# Altium schematic sheet i2c_video_clock.SchDoc
size A3
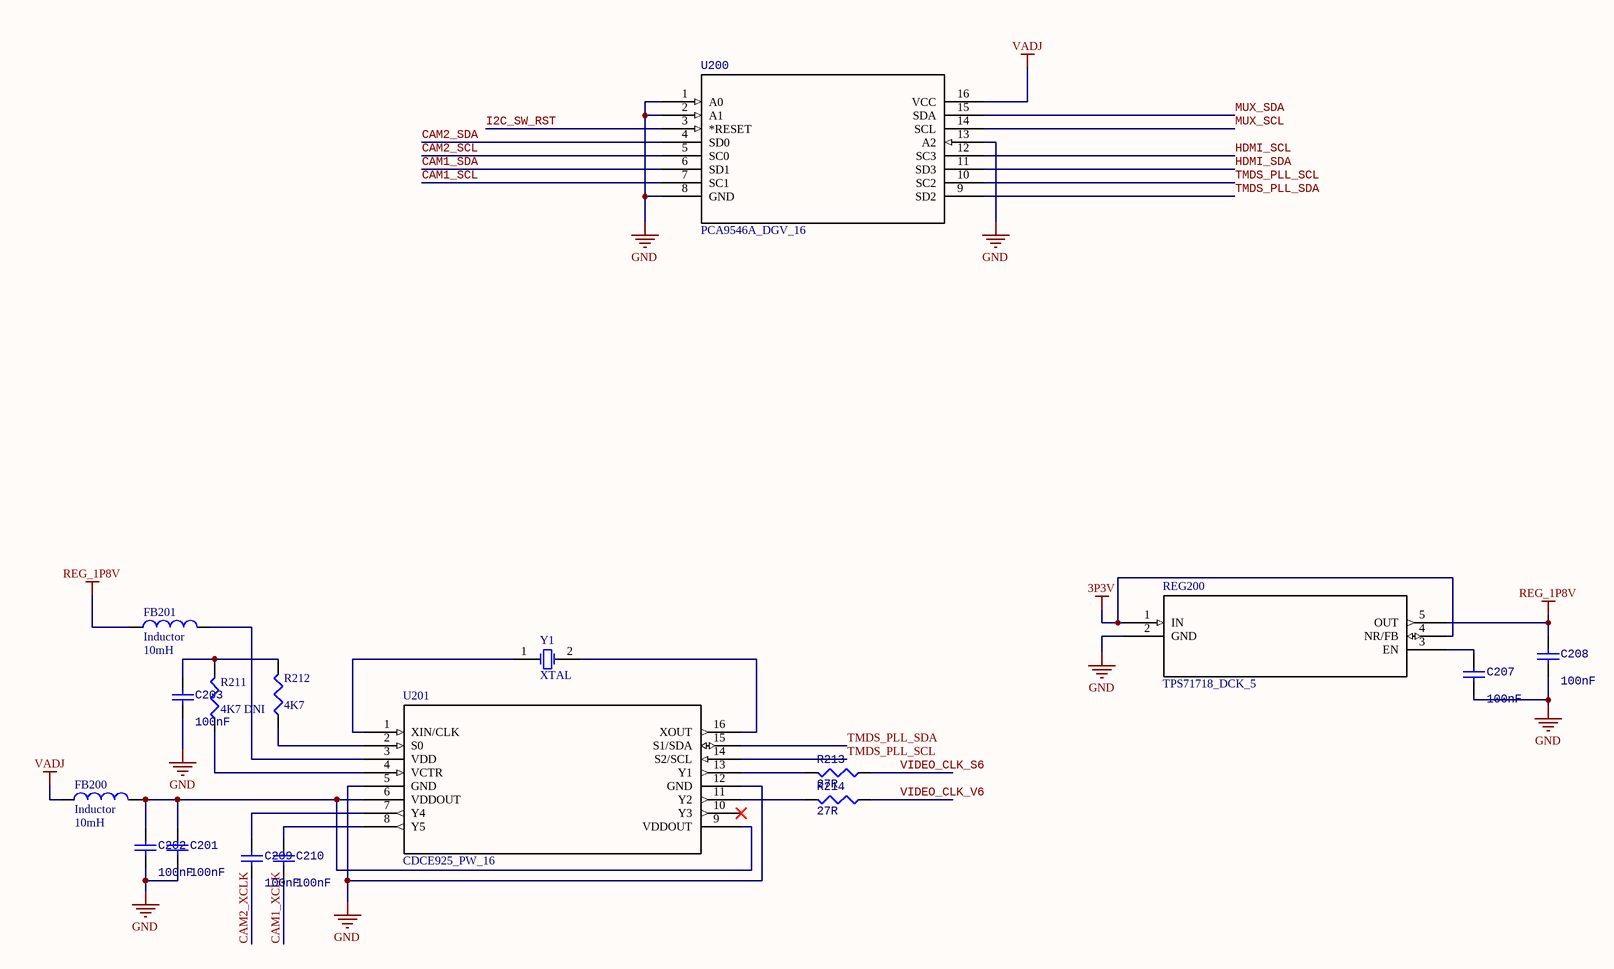
[diagram p0: i2c_video_clock.SchDoc]

## Parts
C201  value 100nF  [1608[0603]]  (hidden comment: Cap)
C202  value 100nF  [1608[0603]]  (hidden comment: Cap)
C203  value 100nF  [1608[0603]]  (hidden comment: Cap)
C207  value 100nF  [1608[0603]]  (hidden comment: Cap)
C208  value 100nF  [1608[0603]]  (hidden comment: Cap)
C209  value 100nF  [1608[0603]]  (hidden comment: Cap)
C210  value 100nF  [1608[0603]]  (hidden comment: Cap)
FB200  Inductor  value 10mH  [0603]
FB201  Inductor  value 10mH  [0603]
R211  value 4K7 DNI  [J1-0603]  (hidden comment: Res3)
R212  value 4K7  [J1-0603]  (hidden comment: Res3)
R213  value 27R  [J1-0603]  (hidden comment: Res3)
R214  value 27R  [J1-0603]  (hidden comment: Res3)
REG200  TPS71718_DCK_5  [DCK5]
U200  PCA9546A_DGV_16  [DGV16]
U201  CDCE925_PW_16  [PW16]
Y1  XTAL  [R38]

## Nets
3P3V: REG200.1(IN) REG200.4(NR/FB)
GND: C201.1 C202.1 C203.1 C207.1 C208.1 REG200.2(GND) U200.1(A0) U200.2(A1) U200.8(GND) U200.13(A2) U201.5(GND) U201.12(GND)
REG_1P8V: C208.2 FB201.1 REG200.5(OUT)
VADJ: FB200.1 U200.16(VCC)
CAM1_SCL: U200.7(SC1)
CAM1_SDA: U200.6(SD1)
CAM1_XCLK: C210.1
CAM2_SCL: U200.5(SC0)
CAM2_SDA: U200.4(SD0)
CAM2_XCLK: C209.1
HDMI_SCL: U200.12(SC3)
HDMI_SDA: U200.11(SD3)
I2C_SW_RST: U200.3(*RESET)
MUX_SCL: U200.14(SCL)
MUX_SDA: U200.15(SDA)
TMDS_PLL_SCL: U200.10(SC2) U201.14(S2/SCL)
TMDS_PLL_SDA: U200.9(SD2) U201.15(S1/SDA)
VIDEO_CLK_S6: R213.1
VIDEO_CLK_V6: R214.1
NetC201_2: C201.2 C202.2 FB200.2 U201.6(VDDOUT) U201.9(VDDOUT)
NetC203_2: C203.2 R211.2 R212.2
NetC207_2: C207.2 REG200.3(EN)
NetC209_2: C209.2 U201.7(Y4)
NetC210_2: C210.2 U201.8(Y5)
NetFB201_2: FB201.2 U201.3(VDD)
NetR211_1: R211.1 U201.4(VCTR)
NetR212_1: R212.1 U201.2(S0)
NetR213_2: R213.2 U201.13(Y1)
NetR214_2: R214.2 U201.11(Y2)
NetU201_1: U201.1(XIN/CLK) Y1.1(OSC1)
NetU201_16: U201.16(XOUT) Y1.2(OSC2)

Not connected (* = marked no-connect by the designer): U201 10(Y3)*

## Library data of the parts
C201-C203 C207-C210 = Cap Semi: Capacitor (Semiconductor SIM Model); Published: 8-Jun-2000; LatestRevisionDate: 29-May-2009; LatestRevisionNote: IPC-7351 Footprint Added.; PackageReference: C1206; Publisher: Altium Limited; PackageDescription: Chip Capacitor
FB200 FB201 = Inductor: Code_IEC: 1005; Published: 8-Jun-2000; LatestRevisionDate: 29-May-2009; LatestRevisionNote: IPC-7351 Footprint Added.; PackageReference: 0402-A; Publisher: Altium Limited; PackageDescription: Chip Inductor; Code_JEITA: 0402
R211-R214 = Res3: Resistor; Published: 8-Jun-2000; LatestRevisionDate: 29-May-2009; LatestRevisionNote: IPC-7351 Footprint Added.; PackageReference: J1-0603; Publisher: Altium Limited; PackageDescription: Chip Resistor
REG200 = TPS71718_DCK_5: Imported; Vendor: Texas Instruments; PACKAGE_DESIGNATOR: DCK; PIN_COUNT: 5; FAMILY_NAME: SINGLE CHANNEL LDO; INDUSTRY_STD_PKG_TYPE: SC70; Manufacturer_Part_Number: tps71718_dck_5; GENERIC_PART_NUMBER: TPS71718; Datasheet URL: http://www.ti.com/lit/gpn/TPS71718; Manufacturer: Texas Instruments; RefDes: RefDes; Type: DEV; Value: Value
U200 = PCA9546A_DGV_16: Imported; Manufacturer: Texas Instruments; INDUSTRY_STD_PKG_TYPE: TVSOP; FAMILY_NAME: I2C MULTIPLEXER, SWITCH; PIN_COUNT: 16; PACKAGE_DESIGNATOR: DGV; Datasheet URL: http://www.ti.com/lit/gpn/PCA9546A; GENERIC_PART_NUMBER: PCA9546A; Vendor: Texas Instruments; Manufacturer_Part_Number: pca9546a_dgv_16; RefDes: RefDes; Type: DEV; Value: Value
U201 = CDCE925_PW_16: Imported; Manufacturer: Texas Instruments; INDUSTRY_STD_PKG_TYPE: TSSOP; FAMILY_NAME: VCXO INPUT; PIN_COUNT: 16; PACKAGE_DESIGNATOR: PW; Datasheet URL: http://www.ti.com/lit/gpn/CDCE925; GENERIC_PART_NUMBER: CDCE925; RefDes: RefDes; Type: DEV; Value: Value
Y1 = XTAL: Crystal Oscillator; Published: 8-Jun-2000; LatestRevisionDate: 17-Jul-2002; LatestRevisionNote: Re-released for DXP Platform.; PackageReference: R38; Publisher: Altium Limited; PackageDescription: Crystal, Thru-Hole; 2 Leads; Body 3.1 x 8.2 mm (Dia.xH)